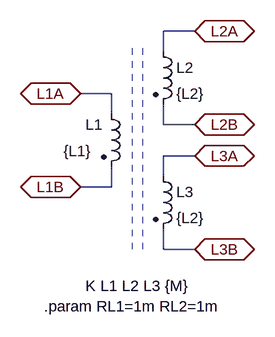
[diagram p0: schematic Trafo3L.asc]
Trafo3L.asc, the LTspice schematic file:
Version 4
SHEET 1 880 680
WIRE 400 112 352 112
WIRE 352 144 352 112
WIRE 272 208 224 208
WIRE 272 240 272 208
WIRE 352 256 352 224
WIRE 400 256 352 256
WIRE 400 304 352 304
WIRE 352 336 352 304
WIRE 272 352 272 320
WIRE 272 352 224 352
WIRE 352 448 352 416
WIRE 400 448 352 448
FLAG 224 208 L1A
IOPIN 224 208 BiDir
FLAG 224 352 L1B
IOPIN 224 352 BiDir
FLAG 400 112 L2A
IOPIN 400 112 BiDir
FLAG 400 256 L2B
IOPIN 400 256 BiDir
FLAG 400 304 L3A
IOPIN 400 304 BiDir
FLAG 400 448 L3B
IOPIN 400 448 BiDir
SYMBOL ind2 256 224 R0
WINDOW 0 -24 32 Left 2
WINDOW 3 -58 73 Left 2
SYMATTR InstName L1
SYMATTR Value {L1}
SYMATTR Type ind
SYMATTR SpiceLine Rser={RL1}
SYMBOL ind2 336 128 R0
SYMATTR InstName L2
SYMATTR Value {L2}
SYMATTR Type ind
SYMATTR SpiceLine Rser={RL2}
SYMBOL ind2 336 320 R0
SYMATTR InstName L3
SYMATTR Value {L2}
SYMATTR Type ind
SYMATTR SpiceLine Rser={RL2}
TEXT 232 504 Left 2 !K L1 L2 L3 {M}
TEXT 168 536 Left 2 !.param RL1=1m RL2=1m
LINE Normal 304 448 304 128 2
LINE Normal 320 448 320 128 2

The netlist it stands for:
* Trafo3L.asc
L1 L1A L1B {L1} Rser={RL1}
L2 L2A L2B {L2} Rser={RL2}
L3 L3A L3B {L2} Rser={RL2}
K L1 L2 L3 {M}
.param RL1=1m RL2=1m
.backanno
.end